# EasyEDA schematic SCH.json
TITLE: MAIKARD; REV: 1.0; Date: 2021-06-29; Sheet: 1/1; Drawn By: Mainak Mondal; Company: Design_LAB
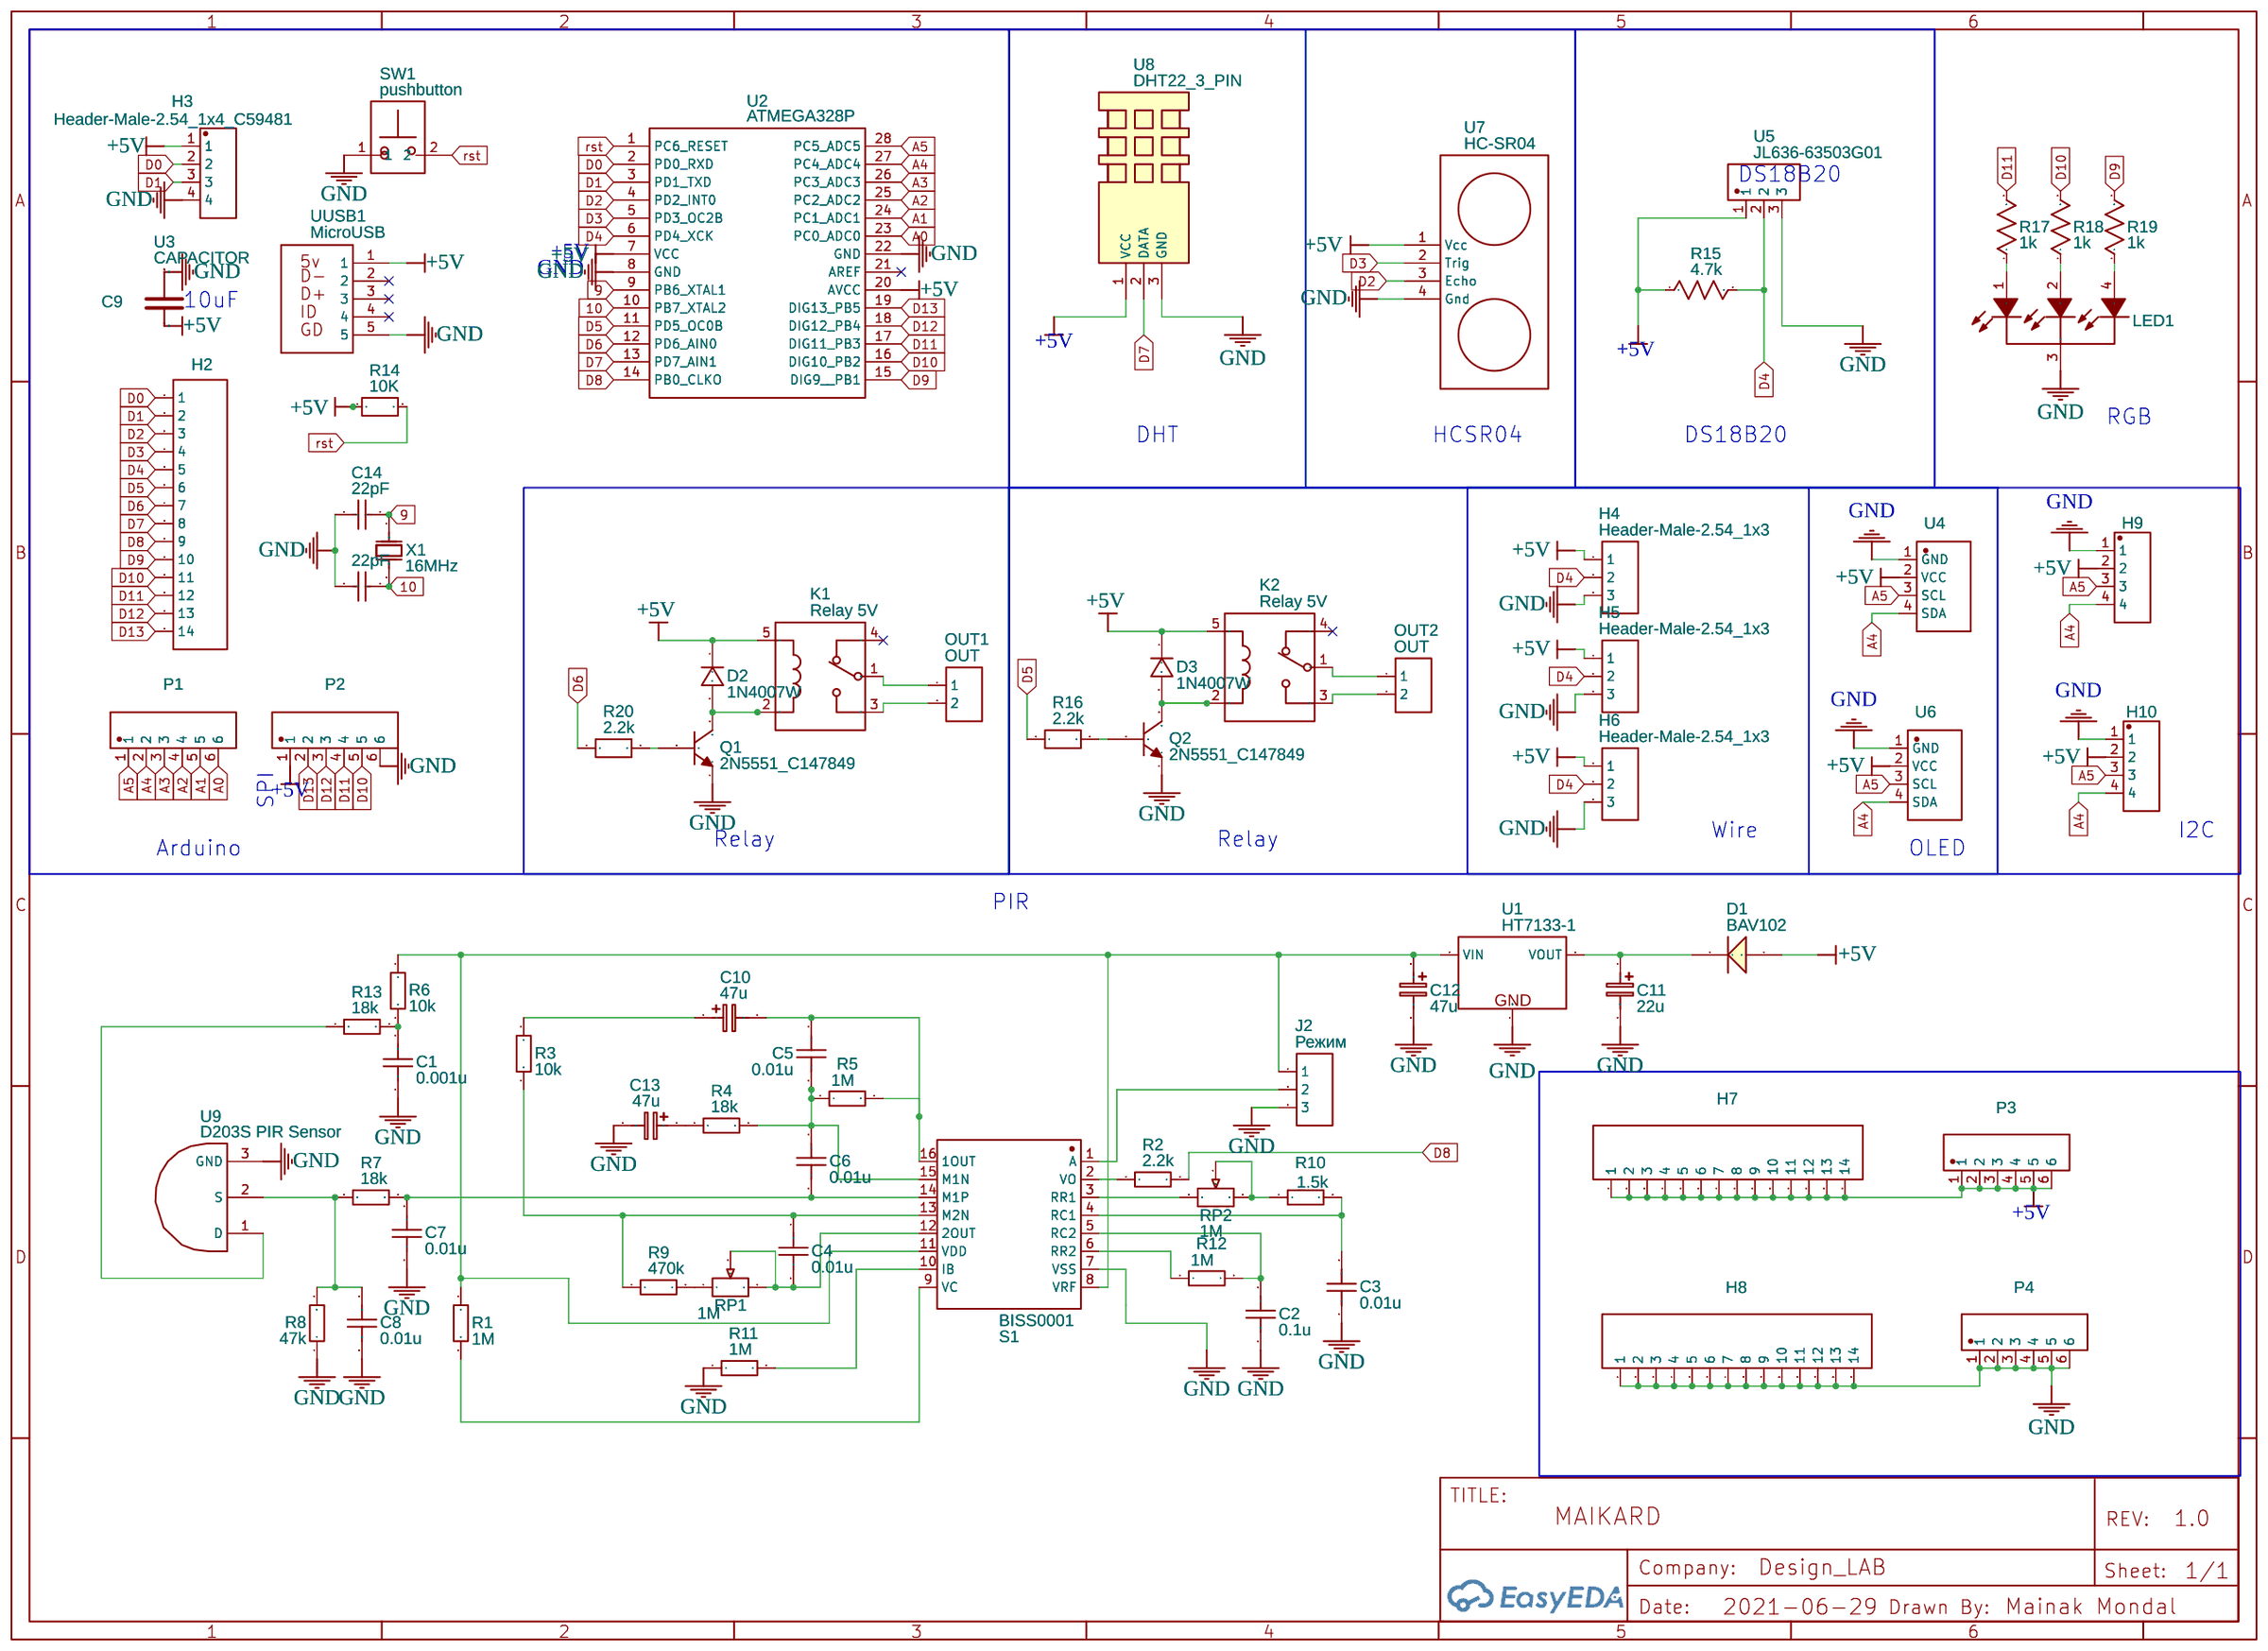
[diagram p0: schematic sheet]

## Parts
C1  0.001u  [C1206]
C2  0.1u  [C1206]
C3  0.01u  [C1206]
C4  0.01u  [C1206]
C5  0.01u  [C1206]
C6  0.01u  [C1206]
C7  0.01u  [C1206]
C8  0.01u  [C1206]
C9  22pF  [RAD-0.1]
C10  47u  [CAP-D3.0×F1.5]
C11  22u  [CAP-D3.0×F1.5]
C12  47u  [CAP-D3.0×F1.5]
C13  47u  [CAP-D3.0×F1.5]
C14  22pF  [RAD-0.1]
D1  BAV102  [SOD80C]
D2  1N4007W  [DO 41]
D3  1N4007W  [DO 41]
H2  Female header 2.54-1*14P  [HDR-TH_14P-P2.54-V]
H3  Header-Male-2.54_1x4_C59481  [HDR-TH_4P-P2.54-V]
H4  Header-Male-2.54_1x3  [HDR-TH_3P-P2.54-V]
H5  Header-Male-2.54_1x3  [HDR-TH_3P-P2.54-V]
H6  Header-Male-2.54_1x3  [HDR-TH_3P-P2.54-V]
H7  Female header 2.54-1*14P  [HDR-TH_14P-P2.54-V]
H8  Female header 2.54-1*14P  [HDR-TH_14P-P2.54-V]
H9  Header-Male-2.54_1x4_C59481  [HDR-TH_4P-P2.54-V]
H10  Header-Male-2.54_1x4_C59481  [HDR-TH_4P-P2.54-V]
J2  Режим  [HDR-M-2.54_1X3]
K1  Relay 5V  [RELAY-TH_HT3F-DCXX-X/X]
K2  Relay 5V  [RELAY-TH_HT3F-DCXX-X/X]
LED1  RGB LED Common Cathode DIP Package  [RGB-5MM]
OUT1  OUT  [HDR-M-2.54_1X2]
OUT2  OUT  [HDR-M-2.54_1X2]
P1  Header-Female-2.54_1x6  [HDR-TH_6P-P2.54-V-F]
P2  Header-Female-2.54_1x6  [HDR-TH_6P-P2.54-V-F]
P3  Header-Female-2.54_1x6  [HDR-TH_6P-P2.54-V-F]
P4  Header-Female-2.54_1x6  [HDR-TH_6P-P2.54-V-F]
Q1  2N5551_C147849  [TO-92-3_L4.9-W3.7-P1.27-L]
Q2  2N5551_C147849  [TO-92-3_L4.9-W3.7-P1.27-L]
R1  1M  [R1206]
R2  2.2k  [R1206]
R3  10k  [R1206]
R4  18k  [R1206]
R5  1M  [R1206]
R6  10k  [R1206]
R7  18k  [R1206]
R8  47k  [R1206]
R9  470k  [R1206]
R10  1.5k  [R1206]
R11  1M  [R1206]
R12  1M  [R1206]
R13  18k  [R1206]
R14  10K  [AXIAL10]
R15  4.7k  [R0201]
R16  2.2k  [R_AXIAL-0.3]
R17  1k  [R0201]
R18  1k  [R0201]
R19  1k  [R0201]
R20  2.2k  [R_AXIAL-0.3]
RP1  1M  [RES-ADJ-TH_3386P]
RP2  1M  [RES-ADJ-TH_3386P]
S1  BISS0001  [SOP-16]
SW1  pushbutton  [AXIAL-0.4]
U1  HT7133-1  [SOT-89_L4.5-W2.5-P1.50-LS4.2-BR]
U2  ATMEGA328P  [DIP-28_300MIL]
U3  CAPACITOR  [TWO_IO]
U4  0.96 128X64 I2C SSD1306 OLED WHITE/BLUE  [0.96 128X64 I2C SSD1306 OLED WHITE/BLUE]
U5  JL636-63503G01  [CONN-TH_3P-P6.35_JL636-63503G01]
U6  0.96 128X64 I2C SSD1306 OLED WHITE/BLUE  [0.96 128X64 I2C SSD1306 OLED WHITE/BLUE]
U7  HC-SR04  [HCSR04]
U8  DHT22_3_PIN  [DHT22_3_WIRES(CLJ)]
U9  D203S PIR Sensor  [TO-5_3PIN-L9.20-W9.20-PITCH2.54-L]
UUSB1  MicroUSB  [MICRO USB]
X1  16MHz  [OSC-49S-1]

## Library data of the parts
C1-C8 = C_0603_US: Contributor: LCEDA_Lib
C9 C14 = 22pF: Voltage: 50V; Tolerance: ±10%; Supplier Part: C9316; Supplier: LCSC; Manufacturer: ReliaPro; Manufacturer Part: 22pf/50V 10%
C10-C13 = CE_TH_D3.0×F1.5_EU: Contributor: LCEDA_Lib
D1 = BAV102: General-purpose Diode
D2 D3 = 1N4007W: Supplier: LCSC; Supplier Part: C328592; Manufacturer: BLUE ROCKET; Contributor: LCEDA_Lib
H2 H7 H8 = Female header 2.54-1*14P: Supplier: LCSC; Manufacturer: BOOMELE; Supplier Part: C52711
H3 H9 H10 = Header-Male-2.54_1x4_C59481: Supplier: LCSC; Manufacturer: ReliaPro; Manufacturer Part: Headers  Pins 1*4P; Supplier Part: C59481
H4-H6 = Header-Male-2.54_1x3: Supplier: LCSC; Manufacturer: BOOMELE; Manufacturer Part: Header2.54mm 1*3P; Supplier Part: C49257; JLCPCB Part Class: Extended Part
J2 = HDR-M-2.54_1x3: Supplier Part: C180248; Supplier: LCSC; Contributor: LCEDA_Lib
K1 K2 = RelayHT3F-12VDC-SHG: Supplier: LCSC; Manufacturer: HTV; image: //image.lceda.cn/szlcsc/C22022.jpg; Supplier Part: C22022
LED1 = RGB LED Common Cathode DIP Package: Manufacturer: KENTO; Manufacturer Part: φ5 RGB Transparent LED; Contributor: Kurt Emmanuel Kellner Juarez; Supplier Part: C32985
OUT1 OUT2 = HDR-M-2.54_1x2: Supplier Part: C124375; Supplier: LCSC; Contributor: LCEDA_Lib
P1-P4 = Header-Female-2.54_1x6: Supplier: LCSC; Manufacturer: BOOMELE; Manufacturer Part: Female header 1*6p; Supplier Part: C40877; JLCPCB Part Class: Extended Part
Q1 Q2 = 2N5551_C147849: Supplier: LCSC; Manufacturer: CJ; Manufacturer Part: 2N5551; Contributor: 立创EDA官方封装库; Supplier Part: C147849
R1-R13 = 0.56Ω: Supplier: LCSC; Manufacturer Part: 0.56R(R56) ±1%; Supplier Part: C19772
R14 = 10K: Manufacturer Part: Resistor MF25 10K, 0.25W; Supplier Part: 934-1110; Supplier: Element14; link: http://www.farnell.com/datasheets/1716726.pdf?_ga=2.200856808.715801181.1515396489-258607356.1495180379; Contributor: cc_CGB
R15 R17-R19 = R_0201_US: Contributor: LCEDA_Lib
R16 R20 = R_AXIAL-0.3_EU: Contributor: LCEDA_Lib
RP1 RP2 = R_3386P_EU: Supplier: LCSC; Contributor: LCEDA_Lib; Value(Ω): 10K
S1 = BISS0001: Supplier Part: C82210; Supplier: LCSC
SW1 = pushbutton: Contributor: Tommyca
U1 = HT7133-1: Supplier: LCSC; Supplier Part: C347181; Manufacturer: Youtai Semiconductor Co., Ltd.; Contributor: bambyz
U2 = ATMEGA328P: sourceId: Oic6oiASL; Supplier: LCSC; Manufacturer: MICROCHIP; Manufacturer Part: ATMEGA328P-PU; image: //image.lceda.cn/szlcsc/C33901.jpg; Contributor: Marco Aurélio Rodrigues; Supplier Part: C33901
U3 = CAPACITOR
U4 U6 = 0.96 128X64 I2C SSD1306 OLED WHITE/BLUE: There are two variants of this display; one 25.2x26.0mm and one 27.5x27.8mm, with different mounting holes. The pcb layout accepts both.; Manufacturer: WAVGAT; Manufacturer Part: OLED 4PIN; link: https://www.aliexpress.com/item/32830523451.html; Contributor: koendv
U5 = JL636-63503G01: Supplier: LCSC; Supplier Part: C394553; Manufacturer: JILN; Contributor: LCSC
U7 = HC-SR04: Contributor: allvex
U8 = DHT22_3_PIN: Digital-output relative humidity & temperature sensor/module; sourceId: GkiDrp9vf; Supplier Part: PRODUCT ID: 385; Voltage: 3.3V - 5.5V; Mounted: Yes; Manufacturer: Aosong (Guangzhou) Electronics Co., Ltd.; link: https://cdn-shop.adafruit.com/datasheets/DHT22.pdf; Manufacturer Part: DHT22; Contributor: easy-h-circ
U9 = D203S PIR Sensor: Manufacturer: Nanyang Senba Optical Electronic Co.; Manufacturer Part: D203S; Supplier: LCSC; Supplier Part: C78793; link: https://datasheet.lcsc.com/szlcsc/Nanyang-Senba-Optical-Elec-D203S_C78793.pdf; Contributor: gasparbalint
UUSB1 = MicroUSB: Manufacturer Part: Speaker; Contributor: MAXCCODE
X1 = XTAL16MHZ DIP: Supplier: LCSC; Manufacturer: YXC; Manufacturer Part: X49SD16MSD2SC; Supplier Part: C16212

## Nets
+5V: D1.1(A) D2.1 D3.1 H3.1 H4.1 H5.1 H6.1 H7.1 H7.2 H7.3 H7.4 H7.5 H7.6 H7.7 H7.8 H7.9 H7.10 H7.11 H7.12 H7.13 H7.14 H9.2 H10.2 K1.5 K2.5 P2.1 P3.1 P3.2 P3.3 P3.4 P3.5 P3.6 R14.1 R15.1 U2.7(VCC) U2.20(AVCC) U3.P$1 U4.2(VCC) U5.1 U6.2(VCC) U7.1(Vcc) U8.1(VCC) UUSB1.1
GND: C1.1 C2.2 C3.1 C7.1 C8.2 C9.1 C11.2 C12.2 C13.2 C14.1 H3.4 H4.3 H5.3 H6.3 H8.1 H8.2 H8.3 H8.4 H8.5 H8.6 H8.7 H8.8 H8.9 H8.10 H8.11 H8.12 H8.13 H8.14 H9.1 H10.1 J2.3 LED1.3(A) P2.6 P4.1 P4.2 P4.3 P4.4 P4.5 P4.6 Q1.1(E) Q2.1(E) R8.1 R11.1 S1.7(VSS) SW1.1 U1.1(GND) U2.8(GND) U2.22(GND) U3.P$2 U4.1(GND) U5.3 U6.1(GND) U7.4(Gnd) U8.3(GND) U9.3(GND) UUSB1.5
9: C14.2 U2.9(PB6 XTAL1) X1.1(OSC1)
10: C9.2 U2.10(PB7 XTAL2) X1.2(OSC2)
A0: P1.6 U2.23(PC0 ADC0)
A1: P1.5 U2.24(PC1 ADC1)
A2: P1.4 U2.25(PC2 ADC2)
A3: P1.3 U2.26(PC3 ADC3)
A4: H9.4 H10.4 P1.2 U2.27(PC4 ADC4) U4.4(SDA) U6.4(SDA)
A5: H9.3 H10.3 P1.1 U2.28(PC5 ADC5) U4.3(SCL) U6.3(SCL)
D0: H2.1 H3.2 U2.2(PD0 RXD)
D1: H2.2 H3.3 U2.3(PD1 TXD)
D2: H2.3 U2.4(PD2 INT0) U7.3(Echo)
D3: H2.4 U2.5(PD3 OC2B) U7.2(Trig)
D4: H2.5 H4.2 H5.2 H6.2 R15.2 U2.6(PD4 XCK) U5.2
D5: H2.6 R16.1 U2.11(PD5 OC0B)
D6: H2.7 R20.1 U2.12(PD6 AIN0)
D7: H2.8 U2.13(PD7 AIN1) U8.2(DATA)
D8: H2.9 R2.2 U2.14(PB0 CLKO)
D9: H2.10 R19.2 U2.15(DIG9  PB1)
D10: H2.11 P2.5 R18.2 U2.16(DIG10 PB2)
D11: H2.12 P2.4 R17.2 U2.17(DIG11 PB3)
D12: H2.13 P2.3 U2.18(DIG12 PB4)
D13: H2.14 P2.2 U2.19(DIG13 PB5)
rst: R14.2 SW1.2 U2.1(PC6 RESET)
Net-(C1-2): C1.2 R6.2 R13.2
Net-(C2-1): C2.1 R12.2 S1.5(RC2)
Net-(C3-2): C3.2 R10.2 S1.4(RC1)
Net-(C4-1): C4.1 R3.2 R9.1 S1.13(M2N)
Net-(C4-2): C4.2 RP1.2 RP1.3 S1.12(2OUT)
Net-(C5-1): C5.1 C10.2 R5.2 S1.16(1OUT)
Net-(C5-2): C5.2 C6.1 R4.2 R5.1 S1.15(M1N)
Net-(C6-2): C6.2 C7.2 R7.2 S1.14(M1P)
Net-(C8-1): C8.1 R7.1 R8.2 U9.2(S)
Net-(C10-1): C10.1 R3.1
Net-(C11-1): C11.1 D1.2(K) U1.3(VOUT)
Net-(C12-1): C12.1 J2.1 R1.1 R6.1 S1.8(VRF) S1.11(VDD) U1.2(VIN)
Net-(C13-1): C13.1 R4.1
Net-(D2-2): D2.2 K1.2 Q1.3(C)
Net-(D3-2): D3.2 K2.2 Q2.3(C)
Net-(J2-2): J2.2 S1.1(A)
Net-(K1-1): K1.1 OUT1.1
Net-(K1-3): K1.3 OUT1.2
Net-(K2-1): K2.1 OUT2.1
Net-(K2-3): K2.3 OUT2.2
Net-(LED1-1): LED1.1(K) R17.1
Net-(LED1-2): LED1.2(K) R18.1
Net-(LED1-4): LED1.4(K) R19.1
Net-(Q1-2): Q1.2(B) R20.2
Net-(Q2-2): Q2.2(B) R16.2
Net-(R1-2): R1.2 S1.9(VC)
Net-(R2-1): R2.1 S1.2(VO)
Net-(R9-2): R9.2 RP1.1
Net-(R10-1): R10.1 RP2.2 RP2.3
Net-(R11-2): R11.2 S1.10(IB)
Net-(R12-1): R12.1 S1.6(RR2)
Net-(R13-1): R13.1 U9.1(D)
Net-(RP2-1): RP2.1 S1.3(RR1)

Not connected (* = marked no-connect by the designer): K1 4*; K2 4*; U2 21(AREF)*; UUSB1 2* 3* 4*

## Notes on the sheet
- DS18B20
- +5V
- GND
- 10uF
- RGB
- DHT
- HCSR04
- DS18B20
- SPI
- Wire
- I2C
- Arduino
- Relay
- Relay
- OLED
- PIR
